# EAGLE schematic rbroce_schematic (EAGLE 9.5.2)
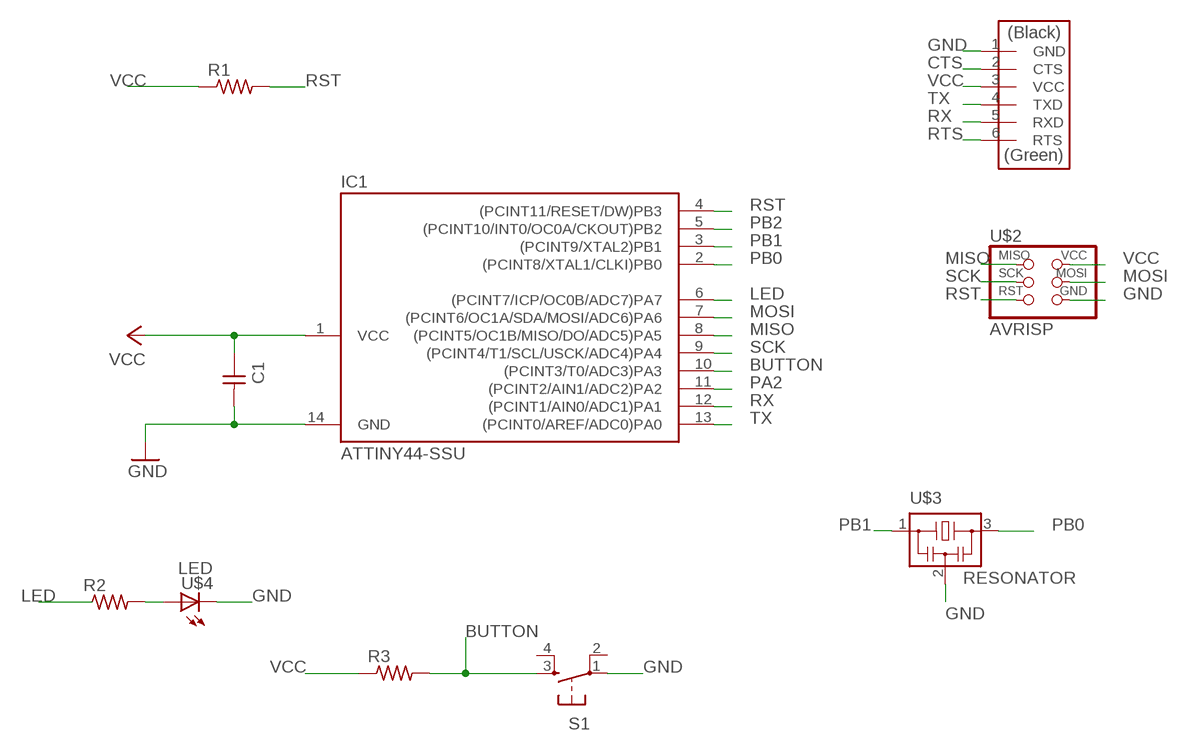
[diagram p0: schematic, sheet 1]

## Parts
C1  CAP-UNPOLARIZED  [C1206]
IC1  ATTINY44-SSU  [SOIC14]
R1  RES-US1206FAB  [R1206FAB]
R2  RES-US1206  [R1206]
R3  RES-US1206  [R1206]
S1  6MM_SWITCH6MM_SWITCH  [6MM_SWITCH]
U$1  FTDI-SMD-HEADER  [1X06SMD]
U$2  AVRISP  [2X03]
U$3  RESONATOR  [EFOBM]
U$4  LED  [LED1206]

## Nets
BUTTON: IC1.10((PCINT3/T0/ADC3)PA3) R3.2 S1.3(S)
CTS: U$1.2(CTS)
GND: C1.2 IC1.14(GND) S1.1(P) U$1.1(GND) U$2.6(GND) U$3.2 U$4.2(C)
LED: IC1.6((PCINT7/ICP/OC0B/ADC7)PA7) R2.1
MISO: IC1.8((PCINT5/OC1B/MISO/DO/ADC5)PA5) U$2.1(MISO)
MOSI: IC1.7((PCINT6/OC1A/SDA/MOSI/ADC6)PA6) U$2.4(MOSI)
N$1: R2.2 U$4.1(A)
PA2: IC1.11((PCINT2/AIN1/ADC2)PA2)
PB0: IC1.2((PCINT8/XTAL1/CLKI)PB0) U$3.3
PB1: IC1.3((PCINT9/XTAL2)PB1) U$3.1
PB2: IC1.5((PCINT10/INT0/OC0A/CKOUT)PB2)
RST: IC1.4((PCINT11/RESET/DW)PB3) R1.2 U$2.5(RST)
RTS: U$1.6(RTS)
RX: IC1.12((PCINT1/AIN0/ADC1)PA1) U$1.5(RXD)
SCK: IC1.9((PCINT4/T1/SCL/USCK/ADC4)PA4) U$2.3(SCK)
TX: IC1.13((PCINT0/AREF/ADC0)PA0) U$1.4(TXD)
VCC: C1.1 IC1.1(VCC) R1.1 R3.1 U$1.3(VCC) U$2.2(VCC)
Unconnected: S1.2(P1) S1.4(S1)

## Library data of the parts
C1 = fab:CAP-UNPOLARIZED
IC1 = fab:ATTINY44
R1-R3 = fab:RES-US: Resistor (US Symbol) Variants with postfix FAB are widened to allow the routing of internal traces
S1 = fab:6MM_SWITCH: OMRON SWITCH
U$1 = fab:FTDI-SMD-HEADER
U$2 = fab:AVRISP
U$3 = fab:RESONATOR
U$4 = fab:LED: LED